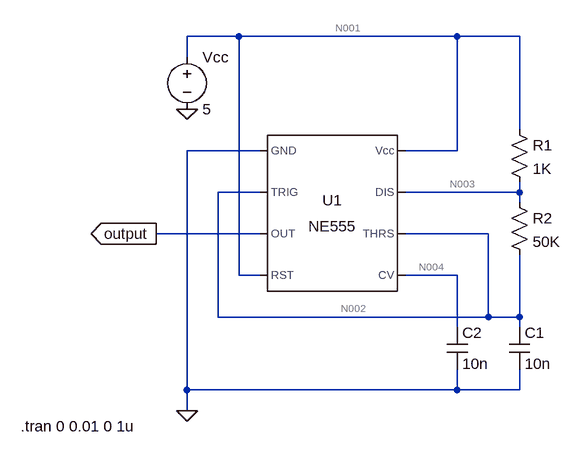
[diagram p0: schematic LM555.asc]
LM555.asc, the LTspice schematic file:
Version 4
SHEET 1 880 680
WIRE 48 -112 -32 -112
WIRE 384 -112 48 -112
WIRE 480 -112 384 -112
WIRE -32 -80 -32 -112
WIRE 480 32 480 -112
WIRE 80 64 -32 64
WIRE 384 64 384 -112
WIRE 384 64 304 64
WIRE 80 128 16 128
WIRE 480 128 480 112
WIRE 480 128 304 128
WIRE 480 144 480 128
WIRE 80 192 -80 192
WIRE 432 192 304 192
WIRE 48 256 48 -112
WIRE 80 256 48 256
WIRE 384 256 304 256
WIRE 16 320 16 128
WIRE 432 320 432 192
WIRE 432 320 16 320
WIRE 480 320 480 224
WIRE 480 320 432 320
WIRE 384 336 384 256
WIRE 480 336 480 320
WIRE -32 432 -32 64
WIRE 384 432 384 400
WIRE 384 432 -32 432
WIRE 480 432 480 400
WIRE 480 432 384 432
WIRE -32 464 -32 432
FLAG -32 464 0
FLAG -32 0 0
FLAG -80 192 output
IOPIN -80 192 Out
SYMBOL Misc\\NE555 192 160 R0
SYMATTR InstName U1
SYMBOL Misc\\EuropeanCap 464 336 R0
SYMATTR InstName C1
SYMATTR Value 10n
SYMBOL Misc\\EuropeanCap 368 336 R0
SYMATTR InstName C2
SYMATTR Value 10n
SYMBOL res 464 16 R0
SYMATTR InstName R1
SYMATTR Value 1K
SYMBOL res 464 128 R0
SYMATTR InstName R2
SYMATTR Value 50K
SYMBOL voltage -32 -96 R0
WINDOW 123 0 0 Left 0
WINDOW 39 0 0 Left 0
SYMATTR InstName Vcc
SYMATTR Value 5
TEXT -288 488 Left 2 !.tran 0 0.01 0 1u

The netlist it stands for:
* LM555.asc
XU1 0 N002 output N001 N004 N002 N003 N001 NE555  ; pins GND TRIG OUT RST CV THRS DIS Vcc
C1 N002 0 10n
C2 N004 0 10n
R1 N001 N003 1K
R2 N003 N002 50K
Vcc N001 0 5
.tran 0 0.01 0 1u
.lib NE555.sub
.backanno
.end

* Results of the author's LTspice run, read from the files saved beside the schematic
* Operating Point, zero values left out:
*   V(n002) = 4.999 V
*   V(n004) = 3.333 V
*   V(n001) = 5 V
*   V(n003) = 5 V
*   V(output) = 5 V
*   I(R2) = 9.999 nA
*   I(R1) = 16.67 nA
*   I(Vcc) = -1.611 mA
*   Ix(u1:1) = -1.611 mA
*   Ix(u1:2) = 4.999 nA
*   Ix(u1:4) = 22.67 µA
*   Ix(u1:6) = 4.999 nA
*   Ix(u1:7) = 6.672 nA
*   Ix(u1:8) = 1.588 mA
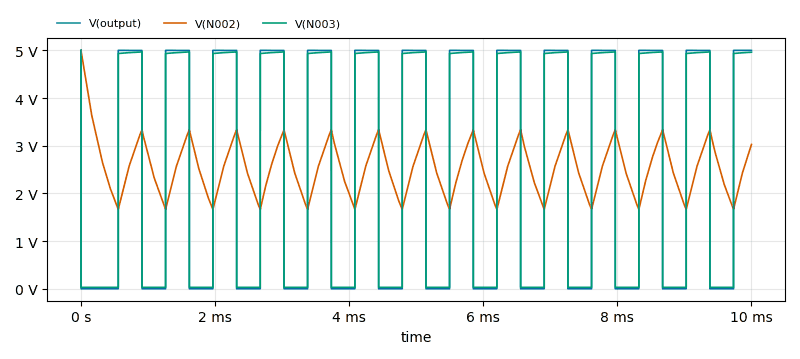
[diagram p1: Transient Analysis of LM555.asc, plotted from the saved traces]
* Transient Analysis, 1 run:
*   V(output): min 30 µV, max 5 V, average 2.436 V, rms 3.49 V, last 5 V
*   V(N002): min 1.665 V, max 4.999 V, average 2.528 V, rms 2.602 V, last 3.027 V
*   V(N003): min 30.02 mV, max 5 V, average 2.428 V, rms 3.457 V, last 4.961 V